# Altium project KeyboardControl.PrjPcb
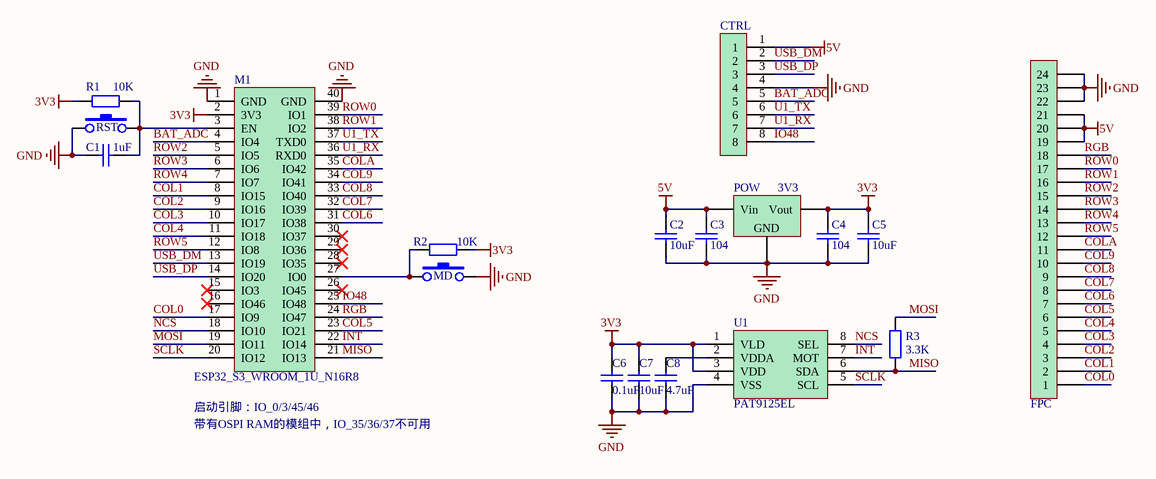
[diagram p0: KeyboardControl.SchDoc]
1 sheet, 18 parts. Net scope: global (net labels, ports and power ports of the same name join across sheets).
Board file: KeyboardControl.PcbDoc

## Sheet KeyboardControl.SchDoc
size A4; SheetNumber: 1; SheetTotal: 1

### Parts
C1  1uF  [0603]
C2  10uF  [0603]
C3  104  [0603]
C4  104  [0603]
C5  10uF  [0603]
C6  0.1uF  [0603]
C7  10uF  [0603]
C8  4.7uF  [0603]
CTRL  SH1.25mm_8P  [SH1.25MM_8P]  (value not drawn)
FPC  FPC_0.5_24P  [FPC_0.5_24PIN]  (value not drawn)
M1  ESP32_S3_WROOM_1U_N16R8  [ESP32_S3_WROOM_1U]
MD  KEY  [KEY_SMT_4_L]  (value not drawn)
POW  3V3  [SOT223]
R1  10K  [R_0603]
R2  10K  [R_0603]
R3  3.3K  [R_0603]
RST  KEY  [KEY_SMT_4_L]  (value not drawn)
U1  PAT9125EL  [PAT9125EL]

### Nets
3V3: C4.2 C5.2 C6.2 C7.2 M1.2(3V3) POW.2(Vout) R1.2 R2.1 U1.1(VLD) U1.3(VDD)
5V: C2.2 C3.2 CTRL.1 FPC.19 FPC.20 FPC.21 POW.3(Vin)
GND: C1.1 C2.1 C3.1 C4.1 C5.1 C6.1 C7.1 C8.1 CTRL.4 FPC.22 FPC.23 FPC.24 M1.1(GND) M1.40(GND) MD.2 POW.1(GND) RST.1 U1.4(VSS)
BAT_ADC: CTRL.5 M1.4(IO4)
COL0: FPC.1 M1.17(IO9)
COL1: FPC.2 M1.8(IO15)
COL2: FPC.3 M1.9(IO16)
COL3: FPC.4 M1.10(IO17)
COL4: FPC.5 M1.11(IO18)
COL5: FPC.6 M1.23(IO21)
COL6: FPC.7 M1.31(IO38)
COL7: FPC.8 M1.32(IO39)
COL8: FPC.9 M1.33(IO40)
COL9: FPC.10 M1.34(IO41)
COLA: FPC.11 M1.35(IO42)
INT: M1.22(IO14) U1.7(MOT)
IO48: CTRL.8 M1.25(IO48)
MISO: M1.21(IO13) R3.1 U1.6(SDA)
MOSI: M1.19(IO11) R3.2
NCS: M1.18(IO10) U1.8(SEL)
RGB: FPC.18 M1.24(IO47)
ROW0: FPC.17 M1.39(IO1)
ROW1: FPC.16 M1.38(IO2)
ROW2: FPC.15 M1.5(IO5)
ROW3: FPC.14 M1.6(IO6)
ROW4: FPC.13 M1.7(IO7)
ROW5: FPC.12 M1.12(IO8)
SCLK: M1.20(IO12) U1.5(SCL)
U1_RX: CTRL.7 M1.36(RXD0)
U1_TX: CTRL.6 M1.37(TXD0)
USB_DM: CTRL.2 M1.13(IO19)
USB_DP: CTRL.3 M1.14(IO20)
NetC1_2: C1.2 M1.3(EN) R1.1 RST.2
NetC8_2: C8.2 U1.2(VDDA)
NetM1_27: M1.27(IO0) MD.1 R2.2

Not connected (* = marked no-connect by the designer): M1 15(IO3)* 16(IO46)* 26(IO45)* 28(IO35)* 29(IO36)* 30(IO37)*

### Notes on the sheet
- (near M1) 启动引脚：IO_0/3/45/46
- 带有OSPI RAM的模组中，IO_35/36/37不可用

### Library data of the parts
C1-C8 = CAP_0603: 贴片电容 0603
CTRL = SH1.25mm_8P: SH
FPC = FPC_0.5_24P: FPC 0.5 24Pin
M1 = ESP32_S3_WROOM_1U: ESP32 S3模组
MD RST = KEY_SMT_4_L: 卧式贴片按键 2*4*3.5mm
POW = LDO_AMS1117: 线性稳压器
R1-R3 = RES_0603: 电阻 0603
U1 = PAT9125EL: Optical Tracking Miniature Chip